# EAGLE design signal generator schematic - top (EAGLE 8.3.1)
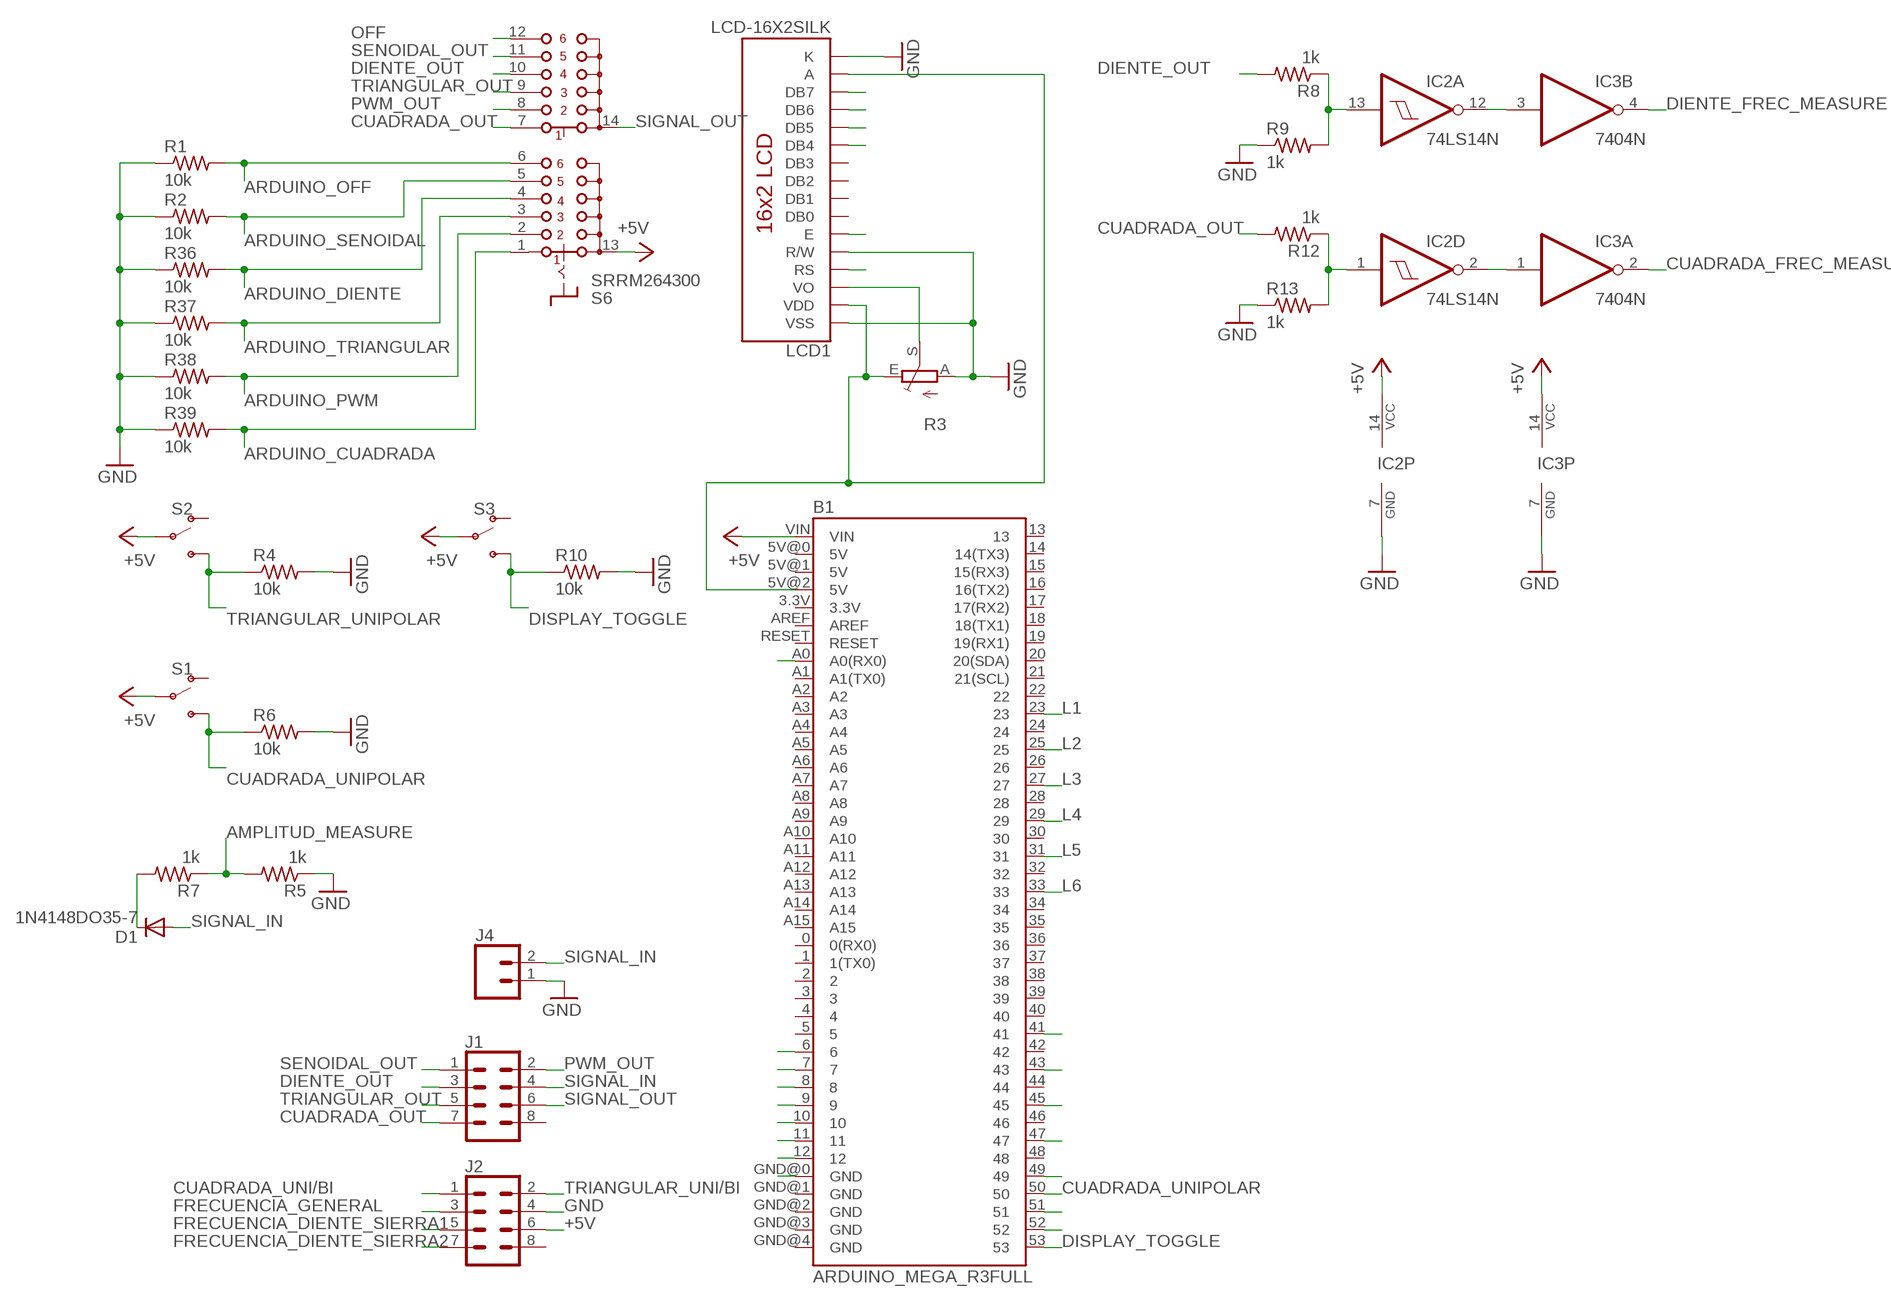
[diagram p0: schematic, sheet 1]

## Parts
B1  ARDUINO_MEGA_R3FULL  [ARDUINO_MEGA]
D1  1N4148DO35-7  [DO35-7]
IC2  74LS14N  [DIL14]
IC3  7404N  [DIL14]
J1  CONN_04X2  [2X4]
J2  CONN_04X2  [2X4]
J4  CONN_025MM  [SCREWTERMINAL-5MM-2]
LCD1  LCD-16X2SILK  [LCD-16X2]
R1  10k  R-US_0207/7  [0207/7]
R2  10k  R-US_0207/7  [0207/7]
R3  TRIM_EU-S63P  [S63P]
R4  10k  R-US_0207/7  [0207/7]
R5  1k  R-US_0207/7  [0207/7]
R6  10k  R-US_0207/7  [0207/7]
R7  1k  R-US_0207/7  [0207/7]
R8  1k  R-US_0207/7  [0207/7]
R9  1k  R-US_0207/7  [0207/7]
R10  10k  R-US_0207/7  [0207/7]
R12  1k  R-US_0207/7  [0207/7]
R13  1k  R-US_0207/7  [0207/7]
R36  10k  R-US_0207/7  [0207/7]
R37  10k  R-US_0207/7  [0207/7]
R38  10k  R-US_0207/7  [0207/7]
R39  10k  R-US_0207/7  [0207/7]
S1  SWITCH-SPDT-PTH-11.6X4.0MM  [SWITCH_SPDT_PTH_11.6X4.0MM]
S2  SWITCH-SPDT-PTH-11.6X4.0MM  [SWITCH_SPDT_PTH_11.6X4.0MM]
S3  SWITCH-SPDT-PTH-11.6X4.0MM  [SWITCH_SPDT_PTH_11.6X4.0MM]
S6  SRRM264300  [SRRM264300]

## Nets
+5V: B1.VIN IC2.14(P:VCC) IC3.14(P:VCC) J2.6 S1.2(P) S2.2(P) S3.2(P) S6.13(A)
AMPLITUD_MEASURE: R5.2 R7.1
AN: B1.A0(A0(RX0))
ARDUINO_CUADRADA: B1.41 R39.2 S6.1(A1)
ARDUINO_DIENTE: B1.47 R36.2 S6.4(A4)
ARDUINO_OFF: B1.51 R1.2 S6.6(A6)
ARDUINO_PWM: B1.43 R38.2 S6.2(A2)
ARDUINO_SENOIDAL: B1.49 R2.2 S6.5(A5)
ARDUINO_TRIANGULAR: B1.45 R37.2 S6.3(A3)
CUADRADA_FREC_MEASURE: B1.6 IC3.2(A:O)
CUADRADA_OUT: J1.7 R12.2 S6.7(C1)
CUADRADA_UNI/BI: B1.9 J2.1
CUADRADA_UNIPOLAR: B1.50 R6.1 S1.3(S)
DIENTE_FREC_MEASURE: B1.7 IC3.4(B:O)
DIENTE_OUT: J1.3 R8.2 S6.10(C4)
DISPLAY_TOGGLE: B1.53 R10.1 S3.3(S)
FRECUENCIA_DIENTE_SIERRA1: B1.11 J2.5
FRECUENCIA_DIENTE_SIERRA2: B1.12 J2.7
FRECUENCIA_GENERAL: B1.10 J2.3
GND: B1.GND@0(GND) IC2.7(P:GND) IC3.7(P:GND) J2.4 J4.1 LCD1.1(VSS) LCD1.5(R/W) LCD1.16(K) R1.1 R2.1 R3.A R4.2 R5.1 R6.2 R9.1 R10.2 R13.1 R36.1 R37.1 R38.1 R39.1
L1: B1.23 LCD1.14(DB7)
L2: B1.25 LCD1.13(DB6)
L3: B1.27 LCD1.12(DB5)
L4: B1.29 LCD1.11(DB4)
L5: B1.31 LCD1.6(E)
L6: B1.33 LCD1.4(RS)
N$2: B1.5V@2(5V) LCD1.2(VDD) LCD1.15(A) R3.E
N$3: LCD1.3(VO) R3.S
N$8: D1.C R7.2
N$9: IC2.12(A:O) IC3.3(B:I)
N$11: IC2.2(D:O) IC3.1(A:I)
N$14: IC2.13(A:I) R8.1 R9.2
N$16: IC2.1(D:I) R12.1 R13.2
OFF: S6.12(C6)
PWM_OUT: J1.2 S6.8(C2)
SENOIDAL_OUT: J1.1 S6.11(C5)
SIGNAL_IN: D1.A J1.4 J4.2
SIGNAL_OUT: J1.6 S6.14(C)
TRIANGULAR_OUT: J1.5 S6.9(C3)
TRIANGULAR_UNI/BI: B1.8 J2.2
TRIANGULAR_UNIPOLAR: B1.52 R4.1 S2.3(S)
Unconnected: B1.0(0(RX0)) B1.1(1(TX0)) B1.2 B1.3 B1.3.3V B1.4 B1.5 B1.5V@0(5V) B1.5V@1(5V) B1.13 B1.14(14(TX3)) B1.15(15(RX3)) B1.16(16(TX2)) B1.17(17(RX2)) B1.18(18(TX1)) B1.19(19(RX1)) B1.20(20(SDA)) B1.21(21(SCL)) B1.22 B1.24 B1.26 B1.28 B1.30 B1.32 B1.34 B1.35 B1.36 B1.37 B1.38 B1.39 B1.40 B1.42 B1.44 B1.46 B1.48 B1.A1(A1(TX0)) B1.A2 B1.A3 B1.A4 B1.A5 B1.A6 B1.A7 B1.A8 B1.A9 B1.A10 B1.A11 B1.A12 B1.A13 B1.A14 B1.A15 B1.AREF B1.GND@1(GND) B1.GND@2(GND) B1.GND@3(GND) B1.GND@4(GND) B1.RESET IC2.3(E:I) IC2.4(E:O) IC2.5(F:I) IC2.6(F:O) IC2.8(C:O) IC2.9(C:I) IC2.10(B:O) IC2.11(B:I) IC3.5(C:I) IC3.6(C:O) IC3.8(D:O) IC3.9(D:I) IC3.10(E:O) IC3.11(E:I) IC3.12(F:O) IC3.13(F:I) J1.8 J2.8 LCD1.7(DB0) LCD1.8(DB1) LCD1.9(DB2) LCD1.10(DB3) S1.1(O) S2.1(O) S3.1(O)

## Library data of the parts
B1 = SparkFun-Boards:ARDUINO_MEGA_R3: Arduino Mega R3 ATmega2560 R3 compatible footprint. SparkFun Products: Arduino Mega 2560 R3 <https://www.sparkfun.com/products/11061>
D1 = diode:1N4148: DIODE high speed (Philips)
IC2 = 74xx-us:74*14: Hex schmitt trigger INVERTER
IC3 = 74xx-us:74*04: Hex INVERTER
J1 J2 = SparkFun-Connectors:CONN_04X2: Multi connection point. Often used as Generic Header-pin footprint for 0.1 inch spaced/style header connections On any of the 0.1 inch spaced packages, you can populate with these: Break Away Headers - Straight <https://www.sparkfun.com/products/116> (PRT-00116) Break Away Male Headers - Right Angle <https://www.sparkfun.com/products/553> (PRT-00553) Female Headers <https://www.sparkfun.com/products/115> (PRT-00115) Break Away Headers - Machine Pin <https://www.sparkfun.com/products/117> (PRT-00117) Break Away Female Headers - Swiss Machine Pin <https://www.sparkfun.com/products/743> (PRT-00743)
J4 = SparkFun-Connectors:CONN_02: Multi connection point. Often used as Generic Header-pin footprint for 0.1 inch spaced/style header connections On any of the 0.1 inch spaced packages, you can populate with these: Break Away Headers - Straight <https://www.sparkfun.com/products/116> (PRT-00116) Break Away Male Headers - Right Angle <https://www.sparkfun.com/products/553> (PRT-00553) Female Headers <https://www.sparkfun.com/products/115> (PRT-00115) Break Away Headers - Machine Pin <https://www.sparkfun.com/products/117> (PRT-00117) Break Away Female Headers - Swiss Machine Pin <https://www.sparkfun.com/products/743> (PRT-00743) For SCREWTERMINALS and SPRING TERMINALS visit here: Screw Terimnals on SparkFun.com <https://www.sparkfun.com/search/results?term=Screw+Terminals> (5mm/3.5mm/2.54mm spacing) This device is also useful as a general connection point to wire up your design to another part of your project. Our various solder wires solder well into these plated through hole pads. Hook-Up Wire - Assortment (Stranded, 22 AWG) <https://www.sparkfun.com/products/11375> (PRT-11375) Hook-Up Wire - Assortment (Solid Core, 22 AWG) <https://www.sparkfun.com/products/11367> (PRT-11367) View the entire wire category on our website here <https://www.sparkfun.com/categories/141> Special notes: Molex polarized connector foot print use with: PRT-08233 with associated crimp pins and housings. 2.54_SCREWTERM for use with PRT-10571. 3.5mm Screw Terminal footprints for PRT-08084 5mm Screw Terminal footprints for use with PRT-08432; SF_SKU: PRT-08432
LCD1 = SparkFun-Displays:LCD-16X2: Standard text-only 16x2 parallel input LCD Basic 16 character by 2 line display. Typically utilizes the extremely common HD44780 parallel interface chipset SparkFun Products: Basic 16x2 Green <https://www.sparkfun.com/products/255> Basic 8x2 Green <https://www.sparkfun.com/products/11122>; SF_ID: LCD-00255
R1 R2 R4-R10 R12 R13 R36-R39 = adafruit:R-US_: RESISTOR, American symbol
R3 = pot:TRIM_EU-: POTENTIOMETER
S1-S3 = SparkFun-Switches:SWITCH-SPDT: Single Pole, Double Throw (SPDT) Switch Single-pole, double-throw (SPDT) switch. Variant Overview SMD-AYZ0202 Surface Mount DPDT Switch <https://www.sparkfun.com/products/597> (COM-00597) Used on e.g. LilyPad Arduino USB - ATmega32U4 Board <https://www.sparkfun.com/products/12049> PTH-11.6X4.0MM SPDT Mini Power Switch <https://www.sparkfun.com/products/102> (COM-00102) Used on e.g. SparkFun Simon Says - Through-Hole Soldering Kit <https://www.sparkfun.com/products/10547> (KIT-10547) PTH-11.6X4.0MM-KIT KIT version of SPDT Mini Power Switch - Simplifies soldering by removing tStop of switch pins - only one side can be soldered. PTH-11.6X4.0MM-LOCK LOCK version of SPDT Mini Power Switch - Offset pins hold switch in place for easier soldering. SMD-RIGHT-ANGLE Surface Mount Right Angle Switch <https://www.sparkfun.com/products/10860> (COM-10860) Used on e.g. SparkFun ESP8266 Thing <https://www.sparkfun.com/products/13231>; PROD_ID: SWCH-08261; SF_SKU: COM-00102
S6 = switch:SRRM2: 12-position General-purpose Vertical Type Rotary Switch 2 Pole 6 Positions Source: ALPS - SRRM.pdf

## Board
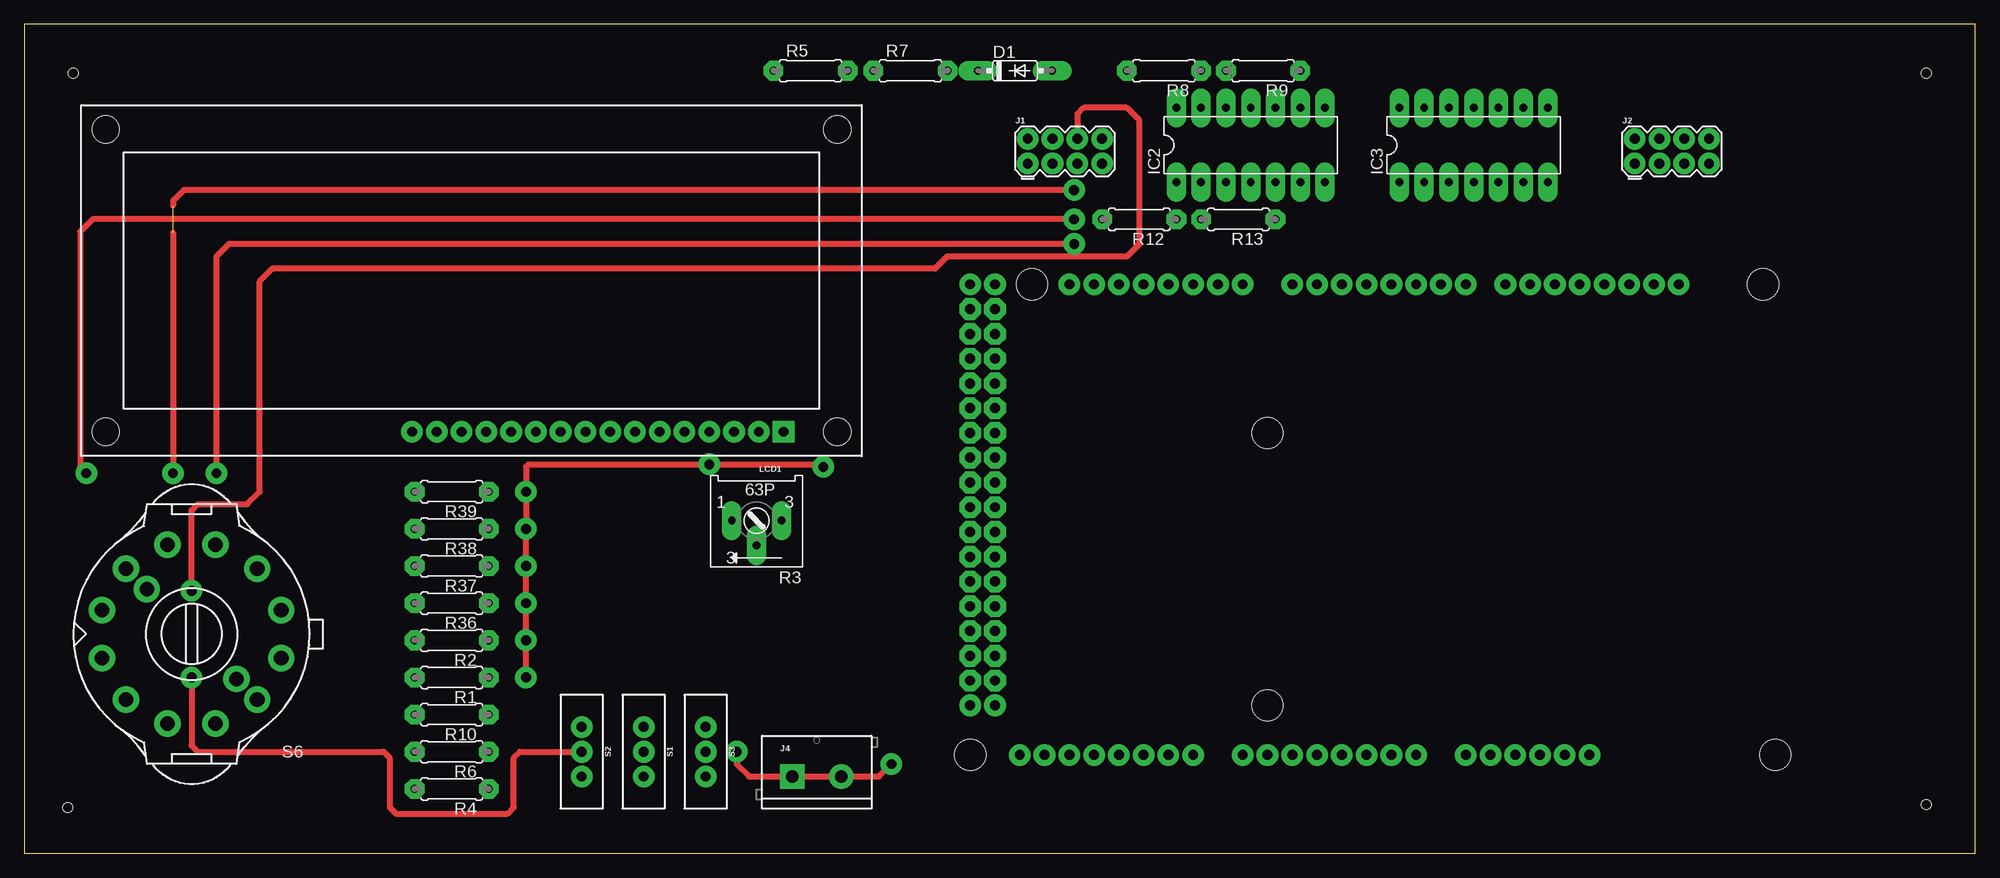
[diagram p1: board, top side]
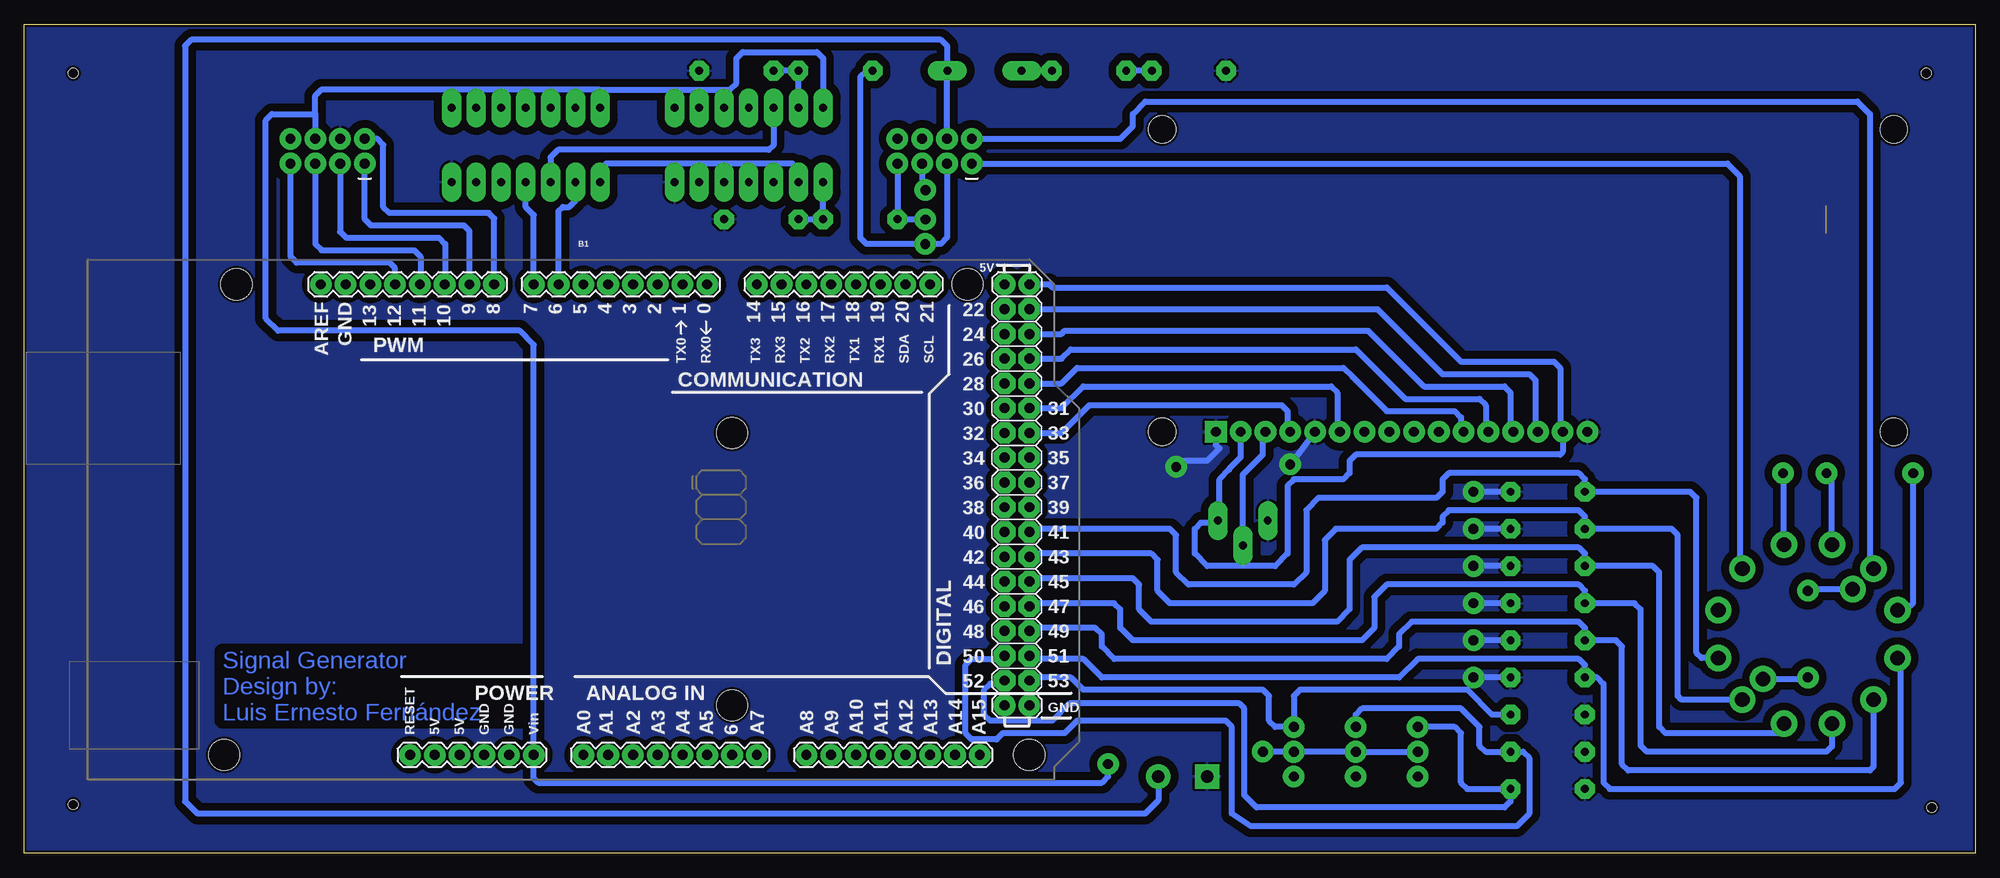
[diagram p2: board, bottom side, seen from below]

Size 200 x 85 mm. Coordinates in mm from the lower left corner, seen from the top.
Outline: 0,0 200,0 200,85 0,85 0,0
Copper layers (1*16): Top 0.035mm / dielectric 1.5mm / Bottom 0.035mm
Design rules "Maker Friendly Design Rules": minimum track width 0.8mm, minimum drill 0.8mm, track to track 0.8mm, track to pad 0.8mm, pad to pad 0.45mm, via to via 0.8mm, smd to smd 8mil, copper to edge 10mil, drill to drill 8mil, minimum pad ring 0.6mm, minimum via ring 0.6mm, stop-mask expansion 0mil, vias tented up to drill 0mil, thermal gap 10mil
Holes 1 mm at 195,80 5,80 195,5 4.45,4.68

### Footprints (pad centres in the part's own frame; a part is rotated, then mirrored left to right if it is on the bottom)
ARDUINO_MEGA = drill 1.016 pad 1.88: 0 13.97,24.13; 1 11.43,24.13; 2 8.89,24.13; 3 6.35,24.13; 3.3V -13.97,-24.13; 4 3.81,24.13; 5 1.27,24.13; 5V@0 -11.43,-24.13; 5V@1 44.45,24.13; 5V@2 46.99,24.13; 6 -1.27,24.13; 7 -3.81,24.13; 8 -7.874,24.13; 9 -10.414,24.13; 10 -12.954,24.13; 11 -15.494,24.13; 12 -18.034,24.13; 13 -20.574,24.13; 14 19.05,24.13; 15 21.59,24.13; 16 24.13,24.13; 17 26.67,24.13; 18 29.21,24.13; 19 31.75,24.13; 20 34.29,24.13; 21 36.83,24.13; A0 1.27,-24.13; A1 3.81,-24.13; A2 6.35,-24.13; A3 8.89,-24.13; A4 11.43,-24.13; A5 13.97,-24.13; A6 16.51,-24.13; A7 19.05,-24.13; A8 24.13,-24.13; A9 26.67,-24.13; A10 29.21,-24.13; A11 31.75,-24.13; A12 34.29,-24.13; A13 36.83,-24.13; A14 39.37,-24.13; A15 41.91,-24.13; AREF -25.654,24.13; GND@0 -8.89,-24.13; GND@1 -6.35,-24.13; GND@2 44.45,-19.05; GND@3 46.99,-19.05; GND@4 -23.114,24.13; RESET -16.51,-24.13; VIN -3.81,-24.13 | drill 1.016 pad 1.88 octagon: 22 44.45,21.59; 23 46.99,21.59; 24 44.45,19.05; 25 46.99,19.05; 26 44.45,16.51; 27 46.99,16.51; 28 44.45,13.97; 29 46.99,13.97; 30 44.45,11.43; 31 46.99,11.43; 32 44.45,8.89; 33 46.99,8.89; 34 44.45,6.35; 35 46.99,6.35; 36 44.45,3.81; 37 46.99,3.81; 38 44.45,1.27; 39 46.99,1.27; 40 44.45,-1.27; 41 46.99,-1.27; 42 44.45,-3.81; 43 46.99,-3.81; 44 44.45,-6.35; 45 46.99,-6.35; 46 44.45,-8.89; 47 46.99,-8.89; 48 44.45,-11.43; 49 46.99,-11.43; 50 44.45,-13.97; 51 46.99,-13.97; 52 44.45,-16.51; 53 46.99,-16.51 | hole 3.2: -34.29,24.13; -35.56,-24.13; 16.51,8.89; 16.51,-19.05; 40.64,24.13; 46.99,-24.13
DO35-7 = drill 0.813 long: A 3.81,0; C -3.81,0
DIL14 = drill 0.813 long: 1 -7.62,-3.81; 2 -5.08,-3.81; 3 -2.54,-3.81; 4 0,-3.81; 5 2.54,-3.81; 6 5.08,-3.81; 7 7.62,-3.81; 8 7.62,3.81; 9 5.08,3.81; 10 2.54,3.81; 11 0,3.81; 12 -2.54,3.81; 13 -5.08,3.81; 14 -7.62,3.81
2X4 = drill 1.016 pad 1.88: 1 -3.81,-1.27; 2 -3.81,1.27; 3 -1.27,-1.27; 4 -1.27,1.27; 5 1.27,-1.27; 6 1.27,1.27; 7 3.81,-1.27; 8 3.81,1.27
SCREWTERMINAL-5MM-2 = drill 1.3 pad 2.032 square: 1 0,0 | drill 1.3 pad 2.032: 2 5,0
LCD-16X2 = drill 1.016 pad 1.88 square: 1 -32,15.5 | drill 1.016 pad 1.88: 2 -29.46,15.5; 3 -26.92,15.5; 4 -24.38,15.5; 5 -21.84,15.5; 6 -19.3,15.5; 7 -16.76,15.5; 8 -14.22,15.5; 9 -11.68,15.5; 10 -9.14,15.5; 11 -6.6,15.5; 12 -4.06,15.5; 13 -1.52,15.5; 14 1.02,15.5; 15 3.56,15.5; 16 6.1,15.5 | hole 2.8: -37.5,15.5; -37.5,-15.5; 37.5,15.5; 37.5,-15.5
0207/7 = drill 0.813 octagon: 1 -3.81,0; 2 3.81,0
S63P = drill 0.813 long: A 2.54,0; E -2.54,0; S 0,2.54
SWITCH_SPDT_PTH_11.6X4.0MM = drill 1.016 pad 1.88: 1 0,2.54; 2 0,0; 3 0,-2.54
SRRM264300 = drill 1.5 pad 2.184: 1 -9.176,2.459; 2 -6.718,6.718; 3 -2.459,9.176; 4 2.459,9.176; 5 6.718,6.718; 6 9.176,2.459; 7 9.176,-2.459; 8 6.718,-6.718; 9 2.459,-9.176; 10 -2.459,-9.176; 11 -6.718,-6.718; 12 -9.176,-2.459; 13 -4.596,4.596; 14 4.596,-4.596

### Placement (x,y rotation side)
B1  143.96,34.21 0 bottom
D1  101.56,80.25 0 top
IC2  125.73,72.63 0 top
IC3  148.59,72.63 0 top
J1  106.68,72 0 top
J2  168.91,72 0 top
J4  78.74,7.86 0 top
LCD1  45.84,58.72 180 top
R1  43.81,18.02 180 top
R2  43.81,21.83 180 top
R3  75.07,34.1 180 top
R4  43.81,6.59 180 top
R5  80.61,80.25 0 top
R6  43.81,10.4 180 top
R7  90.84,80.25 0 top
R8  116.84,80.25 180 top
R9  127,80.25 180 top
R10  43.81,14.21 180 top
R12  114.3,65.01 180 top
R13  124.46,65.01 180 top
R36  43.81,25.64 180 top
R37  43.81,29.45 180 top
R38  43.81,33.26 180 top
R39  43.81,37.07 180 top
S1  63.5,10.4 180 top
S2  57.15,10.4 180 top
S3  69.85,10.4 180 top
S6  17.14,22.47 180 top

### Tracks (layer width: path | path; a pad name or v marks a point on that pad's centre or on a via)
+5V  (via drill 1 pad 1.3)
  Top 0.61: v17.14,18.02 17.14,11.04 17.78,10.4 36.83,10.4 37.47,9.77 37.47,4.68 38.1,4.05 49.53,4.05 50.16,4.68 50.16,9.77 50.8,10.4 S2.2 | v73.03,10.4 73.03,9.13 74.3,7.86 87.63,7.86 v88.9,9.13
  Bottom 0.61: IC2.14 118.11,81.52 118.75,82.16 126.36,82.16 127,81.52 127,78.98 127.68,78.3 141.05,78.3 | S2.2 S1.2 S3.2 v73.03,10.4 | S6.13 17.3,17.87 v17.14,18.02 | v88.9,9.13 88.9,7.86 89.53,7.23 147.32,7.23 147.77,7.68 B1.VIN 147.77,52.12 149.22,53.58 173.99,53.58 175.26,54.85 175.26,75.17 174.62,75.81 170.21,75.81 170.18,75.83 | 141.05,78.3 169.59,78.3 170.18,77.71 170.18,75.83 | 170.18,75.83 J2.6 | IC3.14 140.97,78.22 141.05,78.3
AMPLITUD_MEASURE
  Bottom 0.61: R5.2 R7.1
ARDUINO_CUADRADA
  Bottom 0.61: S6.1 28.02,20.01 28.57,20.56 28.57,36.44 29.21,37.07 R39.2 40.01,38.34 40.64,38.98 53.98,38.98 54.61,38.34 54.61,37.07 55.24,36.44 67.32,36.44 68.58,35.17 68.58,28.81 69.85,27.55 80.64,27.55 81.92,28.81 81.92,32.62 82.55,33.26 96.65,33.26 B1.41
ARDUINO_DIENTE
  Bottom 0.61: S6.4 14.69,10.95 15.24,10.4 33.66,10.4 34.29,11.04 34.29,25.01 34.92,25.64 R36.2 40.01,26.91 40.64,27.55 60.33,27.55 61.59,26.27 61.59,23.1 62.87,21.83 86.36,21.83 87.63,23.1 87.63,25.01 88.27,25.64 96.65,25.64 B1.47
ARDUINO_OFF
  Bottom 0.61: S6.6 7.62,19.66 7.62,7.23 8.26,6.59 37.47,6.59 38.1,7.23 38.1,17.38 38.73,18.02 R1.2 40.01,19.29 40.64,19.92 57.15,19.92 59.05,18.02 89.53,18.02 91.44,19.92 96.66,19.92 B1.51
ARDUINO_PWM
  Bottom 0.61: S6.2 30.11,15.75 30.48,16.11 30.48,32.62 31.11,33.26 R38.2 40.01,34.53 40.64,35.16 53.98,35.16 54.61,34.53 54.61,33.9 55.24,33.26 65.54,33.26 66.67,32.12 66.67,26.91 67.94,25.64 82.55,25.64 83.82,26.91 83.82,30.09 84.45,30.72 96.65,30.72 B1.43
ARDUINO_SENOIDAL
  Bottom 0.61: S6.5 10.43,8.86 10.79,8.5 35.56,8.5 36.2,9.13 36.2,21.2 36.83,21.83 R2.2 40.01,23.1 40.64,23.73 57.78,23.73 59.05,22.47 59.05,21.2 60.33,19.92 88.27,19.92 89.53,21.2 89.53,22.47 90.17,23.1 96.65,23.1 B1.49
ARDUINO_TRIANGULAR
  Bottom 0.61: S6.3 19.6,13.02 20.32,12.3 31.75,12.3 32.38,12.94 32.38,28.81 33.02,29.45 R37.2 40.01,30.72 40.64,31.35 62.87,31.35 64.14,30.09 64.14,25.01 65.41,23.73 84.45,23.73 85.72,25.01 85.72,27.55 86.36,28.18 96.65,28.18 B1.45
CUADRADA_FREC_MEASURE
  Bottom 0.61: B1.6 145.23,65.83 144.78,66.28 144.15,66.28 143.51,66.92 IC3.2
CUADRADA_OUT  (via drill 1 pad 1.3)
  Top 0.61: v107.61,65.01 6.99,65.01 5.71,63.74 5.71,39.61 v6.35,38.98
  Bottom 0.61: J1.7 R12.2 v107.61,65.01 | S6.7 7.07,24.92 6.35,25.64 v6.35,38.98
CUADRADA_UNI/BI
  Bottom 0.61: B1.9 154.37,63.81 154.94,64.38 164.47,64.38 165.1,65.01 J2.1
CUADRADA_UNIPOLAR
  Bottom 0.61: S1.3 63.5,14.21 62.87,14.84 52.7,14.84 50.8,12.94 50.8,11.04 50.16,10.4 R6.1 46.35,10.4 45.72,9.77 45.72,4.05 46.99,2.78 74.3,2.78 76.2,4.05 76.2,12.94 76.83,13.57 92.08,13.57 93.34,12.3 99.72,12.3 100.35,11.67 | 100.35,11.67 100.33,11.67 | 100.35,11.67 102.87,11.67 103.5,12.3 103.5,19.29 102.87,19.92 99.83,19.92 B1.50
DIENTE_FREC_MEASURE
  Bottom 0.61: B1.7 147.77,65.46 148.59,66.28 IC3.4
DIENTE_OUT  (via drill 1 pad 1.3)
  Top 0.61: v19.68,38.98 19.68,61.2 20.95,62.47 v107.63,62.47
  Bottom 0.61: R8.2 113.67,80.25 114.3,79.61 114.3,63.11 113.67,62.47 v107.63,62.47 106.05,62.47 105.41,63.11 J1.3 | S6.10 19.6,38.89 v19.68,38.98
DISPLAY_TOGGLE
  Bottom 0.61: B1.53 96.65,18.02 92.71,18.02 91.44,16.75 73.03,16.75 72.39,16.11 72.39,13.57 71.75,12.94 S3.3 69.85,16.11 69.22,16.75 52.07,16.75 49.53,14.21 R10.1
FRECUENCIA_DIENTE_SIERRA1
  Bottom 0.61: J2.5 170.18,62.47 169.54,61.83 160.02,61.83 159.38,61.2 159.38,58.41 B1.11
FRECUENCIA_DIENTE_SIERRA2
  Bottom 0.61: B1.12 161.99,60 162.56,60.56 172.09,60.56 172.72,61.2 J2.7
FRECUENCIA_GENERAL
  Bottom 0.61: J2.3 167.64,63.74 167,63.11 157.48,63.11 156.84,62.47 156.84,58.41 B1.10
GND  (via drill 1 pad 1.3)
  Top 0.61: v51.44,18.02 v51.44,21.83 v51.44,25.64 v51.44,29.45 v51.44,33.26 v51.44,37.07 51.44,39.61 51.7,39.88 v70.22,39.88 81.65,39.88 v81.92,39.61
  Bottom 0.61: LCD1.5 v70.22,39.88 | R39.1 v51.44,37.07 | R38.1 v51.44,33.26 | R37.1 v51.44,29.45 | R36.1 v51.44,25.64 | R2.1 v51.44,21.83 | R1.1 v51.44,18.02 | LCD1.1 77.84,41.88 77.47,41.52 78.74,40.24 81.28,40.24 v81.92,39.61
  pour Bottom: 201,-1 -1,-1 -1,86 201,86
L1
  Bottom 0.61: B1.23 61.27,55.8 54.61,49.14 45.72,49.14 45.09,48.5 45.09,43.48 LCD1.14
L2
  Bottom 0.61: B1.25 93.67,53.26 93.34,53.58 62.23,53.58 56.52,47.87 48.26,47.87 47.62,47.23 47.62,43.48 LCD1.13
L3
  Bottom 0.61: B1.27 93.67,50.72 92.71,51.67 63.5,51.67 58.42,46.59 50.8,46.59 50.16,45.96 50.16,43.48 LCD1.12
L4
  Bottom 0.61: B1.29 93.67,48.18 92.08,49.77 64.77,49.77 63.82,48.82 | 63.82,48.82 63.5,48.5 | LCD1.11 52.7,43.48 52.7,44.69 53.34,45.33 60.33,45.33 63.82,48.82
L5
  Bottom 0.61: B1.31 93.67,45.64 91.44,47.87 66.04,47.87 65.41,47.23 65.41,43.48 LCD1.6
L6
  Bottom 0.61: B1.33 93.67,43.1 90.81,45.96 71.12,45.96 70.48,45.33 70.48,43.48 LCD1.4
N$2
  Bottom 0.61: LCD1.2 75.3,40.6 76.48,39.42 76.48,39.33 77.47,38.34 77.47,34.24 R3.E 77.82,33.9 79.38,33.9 80.01,33.26 80.01,30.72 78.74,29.45 71.75,29.45 70.48,30.72 70.48,37.7 69.85,38.34 64.77,38.34 64.14,38.98 64.14,40.24 63.5,40.88 42.55,40.88 42.28,41.15 LCD1.15 42.55,43.48 42.55,49.77 43.18,50.41 52.7,50.41 60.33,58.03 94.61,58.03 94.93,58.34 B1.5V@2
N$3
  Bottom 0.61: R3.S 75.07,38.84 73.03,40.88 73.03,42.95 LCD1.3
N$8
  Bottom 0.61: R7.2 D1.C
N$9
  Bottom 0.61: IC2.12 123.19,72.63 123.69,72.14 145.28,72.14 146.05,71.36 IC3.3
N$11
  Bottom 0.61: IC3.1 140.97,70.09 140.34,70.72 121.28,70.72 120.65,70.09 IC2.2
N$14
  Bottom 0.61: IC2.13 R8.1 R9.2
N$16
  Bottom 0.61: IC2.1 R12.1 R13.2
PWM_OUT
  Bottom 0.61: J1.2 87.63,73.27 86.36,74.53 86.36,75.81 85.09,77.08 12.06,77.08 10.79,75.81 10.79,29.55 S6.8
SENOIDAL_OUT
  Bottom 0.61: J1.1 25.4,70.72 24.13,69.45 24.13,29.45 S6.11
SIGNAL_IN
  Bottom 0.61: J1.4 105.41,80.21 D1.A 105.37,82.75 106.05,83.42 182.88,83.42 183.51,82.79 183.51,5.32 182.25,4.05 85.09,4.05 83.74,5.4 J4.2
SIGNAL_OUT  (via drill 1 pad 1.3)
  Top 0.61: v17.14,26.91 17.14,35.16 17.78,35.8 22.86,35.8 24.13,37.07 24.13,58.66 25.4,59.93 93.34,59.93 94.61,61.2 113.03,61.2 114.3,62.47 114.3,75.17 113.03,76.44 108.58,76.44 107.95,75.81 J1.6
  Bottom 0.61: S6.14 16.99,27.06 v17.14,26.91
TRIANGULAR_OUT  (via drill 1 pad 1.3)  (1 unrouted)
  Top 0.61: 15.24,63.6 v15.24,38.98 | v107.61,68.01 16.34,68.01 15.24,66.92 15.24,66.42
  Bottom 0.61: S6.9 14.69,38.42 v15.24,38.98 | J1.5 107.95,68.34 v107.61,68.01
TRIANGULAR_UNI/BI
  Bottom 0.61: B1.8 151.83,65.08 152.4,65.64 162.56,65.64 163.19,66.28 163.19,72.63 163.83,73.27 J2.2
TRIANGULAR_UNIPOLAR
  Bottom 0.61: S2.3 53.34,12.94 52.7,12.3 52.7,7.23 52.07,6.59 R4.1 47.62,5.32 48.26,4.68 73.66,4.68 74.93,5.95 74.93,14.84 75.42,15.34 92.85,15.34 94.61,13.57 100.97,13.57 101.6,14.21 101.6,16.75 100.97,17.38 99.83,17.38 B1.52

### Text on the board
Bottom: Signal Generator / Design by: / Luis Ernesto Fernández